# Altium project Power Supply.PrjPcb
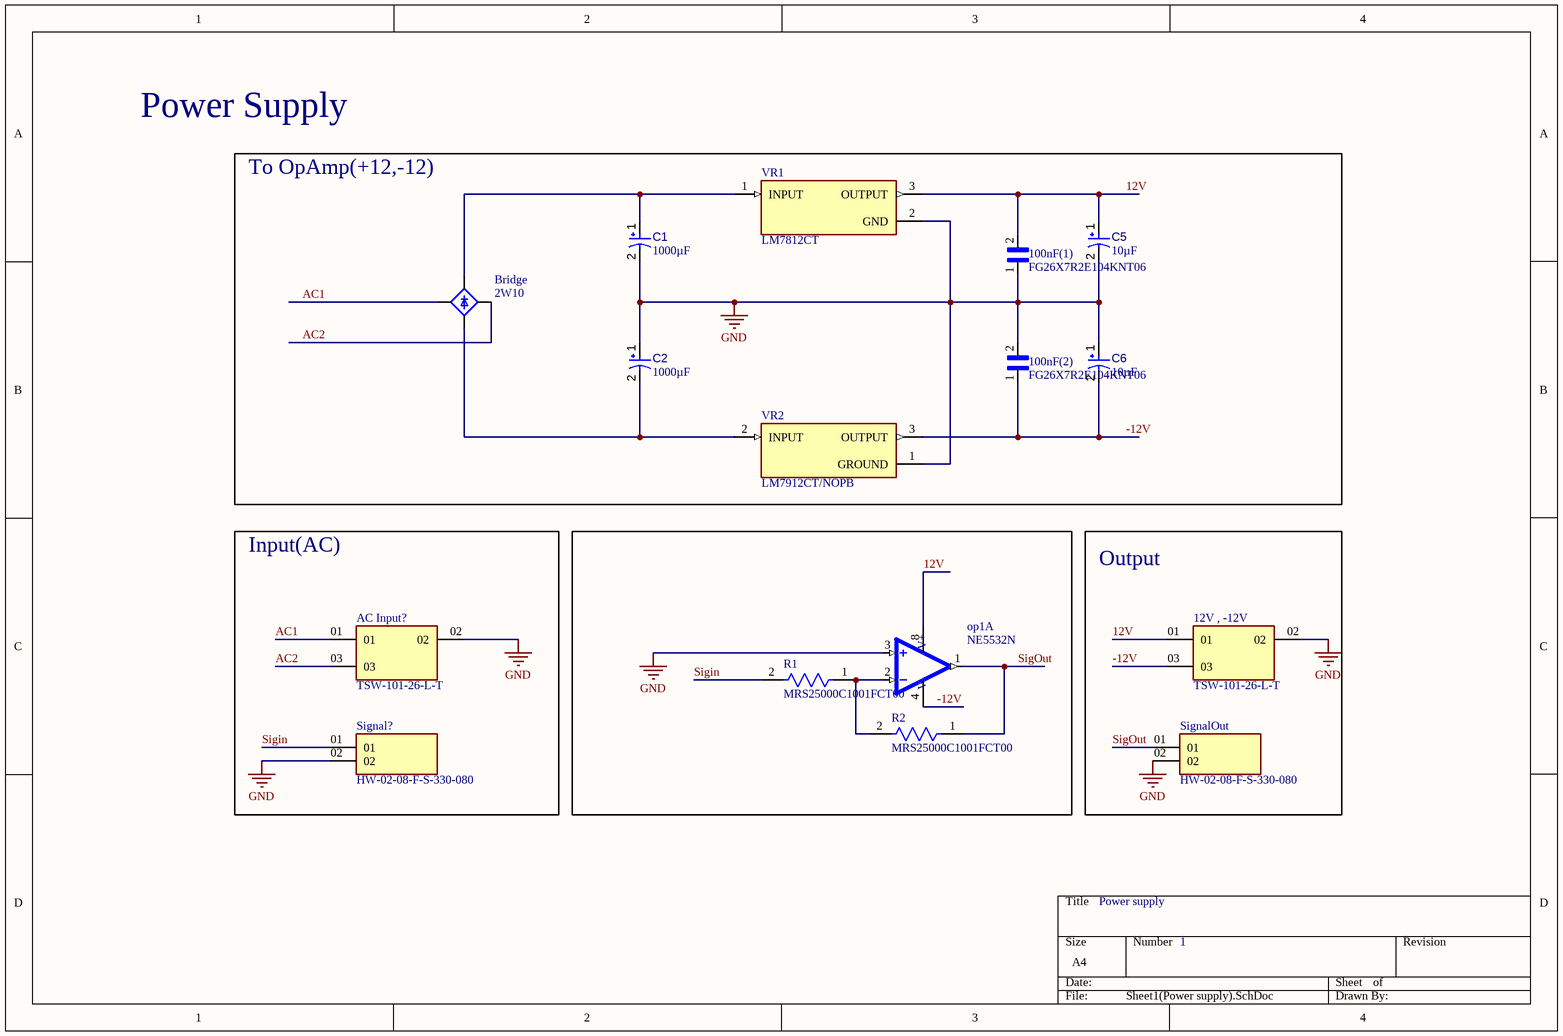
[diagram p0: Sheet1(Power supply).SchDoc]
1 sheet, 16 parts. Net scope: global (net labels, ports and power ports of the same name join across sheets).
Board file: Power Supply.PcbDoc

## Sheet Sheet1(Power supply).SchDoc
size A4; SheetNumber: 1; SheetTotal: 1

### Parts
12V_,_-12V  TSW-101-26-L-T  [SAMTEC_TSW-101-26-L-T]
100nF(1)  FG26X7R2E104KNT06  [CAPRB500W50L550T350H600]
100nF(2)  FG26X7R2E104KNT06  [CAPRB500W50L550T350H600]
AC_Input?  TSW-101-26-L-T  [SAMTEC_TSW-101-26-L-T]
Bridge  2W10  [2W10]
C1  value 1000µF  [CAPPR65-350-1150X800X1250]  (hidden comment: ECA1HM101)
C2  value 1000µF  [CAPPR65-350-1150X800X1250]  (hidden comment: ECA1HM101)
C5  value 10µF  [CAPPR65-350-1150X800X1250]  (hidden comment: ECA1HM101)
C6  value 10µF  [CAPPR65-350-1150X800X1250]  (hidden comment: ECA1HM101)
op1  NE5532N  [DIP766W45P254L1016H533Q8]  (part A of 2)
R1  MRS25000C1001FCT00  [FP-MRS25-MFG]
R2  MRS25000C1001FCT00  [FP-MRS25-MFG]
Signal?  HW-02-08-F-S-330-080  [SAMTEC_HW-02-08-F-S-330-080]
SignalOut  HW-02-08-F-S-330-080  [SAMTEC_HW-02-08-F-S-330-080]
VR1  LM7812CT  [TO253P1057X470X2040-3]
VR2  LM7912CT/NOPB  [TO254P1054X470X1955-3]

### Blocks framed on the sheet
To OpAmp(+12,-12): 100nF(1) 100nF(2) Bridge C1 C2 C5 C6 VR1 VR2
Input(AC): AC_Input? Signal?
Output: 12V_,_-12V SignalOut

### Nets
GND: 12V_,_-12V.02 100nF(1).1 100nF(2).2 AC_Input?.02 C1.2 C2.1 C5.2 C6.1 op1.3(+INA) Signal?.02 SignalOut.02 VR1.2(GND) VR2.1(GROUND)
12V: 12V_,_-12V.01 100nF(1).2 C5.1 op1.8(V+) VR1.3(OUTPUT)
-12V: 12V_,_-12V.03 100nF(2).1 C6.2 op1.4(V-) VR2.3(OUTPUT)
AC1: AC_Input?.01 Bridge.AC1
AC2: AC_Input?.03 Bridge.AC2
Sigin: R1.2 Signal?.01
SigOut: op1.1(OUTA) R2.1 SignalOut.01
NetBridge_+VCC: Bridge.+VCC C1.1 VR1.1(INPUT)
NetBridge_-VDD: Bridge.-VDD C2.2 VR2.2(INPUT)
Netop1_2: op1.2(-INA) R1.1 R2.2

### Notes on the sheet
- Power Supply
- Power supply
- 1

### Library data of the parts
100nF(1) 100nF(2) = FG26X7R2E104KNT06: 0.1ÂµF Â±10% 250V Ceramic Capacitor X7R Radial; MF: TDK; Purchase-URL: https://pricing.snapeda.com/search/part/FG26X7R2E104KNT06/?ref=eda; Package: Radial TDK; Availability: In Stock; Value: *; MP: FG26X7R2E104KNT06; Check_prices: https://www.snapeda.com/parts/FG26X7R2E104KNT06/TDK/view-part/?ref=eda; Price: None; SnapEDA_Link: https://www.snapeda.com/parts/FG26X7R2E104KNT06/TDK/view-part/?ref=snap
Bridge = 2W10: Bridge Rectifier Single Phase Standard 1 kV Through Hole WOM; MF: MDD; SnapEDA_Link: https://www.snapeda.com/parts/2W10/MDD/view-part/?ref=snap; Package: None; Value: *; MP: 2W10; Check_prices: https://www.snapeda.com/parts/2W10/MDD/view-part/?ref=eda
C1 C2 C5 C6 = CMP-001-00026-7: Aluminum Electrolytic Capacitor, 100 uF, +/- 20%, 50 V, -40 to 85 degC, 2-Pin THD, RoHS, Bulk; Manufacturer: Panasonic; Voltage Rating: 50V; Ripple Current: 250mA; Datasheet URL: https://industrial.panasonic.com/cdbs/www-data/pdf/RDF0000/ABA0000C1218.pdf; Lead Pitch: 3.5mm; Mounting Technology: TH; Package Description: 2-Pin Radial Lead, Dia 8 mm, Height 12.5 mm; Diameter: 8mm; Ripple Current (AC): 250mA; Manufacturer URL: http://www.panasonic.com/; Capacitor Type: Electrolytic; Max Operating Temperature: 85°C; Pins: 2; Min Operating Temperature: -40°C; Tolerance: 20%; Case/Package: Radial; Packaging: Bulk; Package Quantity: 200; Package Reference: CAPPR65-350-1150X800X1250; RoHS Compliant: True; Datasheet Version: Rev. 05, 10/2016
op1 = NE5532N: General Purpose Amplifier 2 Circuit 8-PDIP; MF: ON Semiconductor; SnapEDA_Link: https://www.snapeda.com/parts/NE5532N/ON%20Semiconductor/view-part/2701565/?ref=snap; Availability: Unavailable; Value: *; Package: DIP-8 Rochester Electronics; MP: NE5532N; Price: None
R1 R2 = CMP-02408-000051-1: RES 1K OHM 0.6W 1% AXIAL; Power Rating: 600mW; Lead Diameter: 0.6mm; Voltage Rating (DC): 350V; Resistance: 1kR; Temperature Coefficient: 50ppm/°C; Width: 2.5mm; Military Standard: Not; Package Quantity: 5000; Radiation Hardening: No; Case/Package: Axial; Resistance Tolerance: 1%; Resistor Type: Metal Film; Contact Plating: Tin; Length: 6.5mm; Lead Free: Lead Free; RoHS Compliant: Yes; Mount: Through Hole; Number of Pins: 2; Technology: THIN FILM; Voltage Rating: 350V; Min Operating Temperature: -55°C; Weight: 0.00776oz; Diameter: 2.5mm; Construction: Cylindrical; Series: MRS25; Tolerance: 1%; Packaging: Tape and Reel; Max Operating Temperature: 155°C; Max Power Dissipation: 600mW; Number of Terminations: 2; Termination: Axial
VR1 = LM7812CT: Linear Voltage Regulator IC Positive Fixed 1 Output  1A TO-220-3; MF: ON Semiconductor; Package: TO-220; MP: LM7812CT; Check_prices: https://www.snapeda.com/parts/LM7812CT/Onsemi/view-part/?ref=eda; Value: *; Price: None; Availability: Unavailable; SnapEDA_Link: https://www.snapeda.com/parts/LM7812CT/Onsemi/view-part/?ref=snap
VR2 = LM7912CT/NOPB: 1.5-A, negative linear voltage regulator; MF: Texas Instruments; Availability: In Stock; SnapEDA_Link: https://www.snapeda.com/parts/LM7912CT/NOPB/Texas+Instruments/view-part/?ref=snap; Price: None; Check_prices: https://www.snapeda.com/parts/LM7912CT/NOPB/Texas+Instruments/view-part/?ref=eda; Package: TO-220-3 Texas Instruments; MP: LM7912CT/NOPB; Value: *; Purchase-URL: https://pricing.snapeda.com/search/part/LM7912CT/NOPB/?ref=eda
12V_,_-12V AC_Input? = TSW-101-26-L-T: Package: None; Price: None; Value: *; MP: TSW-101-26-L-T; Availability: Unavailable
Signal? SignalOut = HW-02-08-F-S-330-080: Availability: Unavailable; Price: None; Package: None; MP: HW-02-08-F-S-330-080; Value: *